# EAGLE schematic wachcio_nawodnienie (EAGLE 7.7.0)

## Sheet 1 of 4: urzadzenie
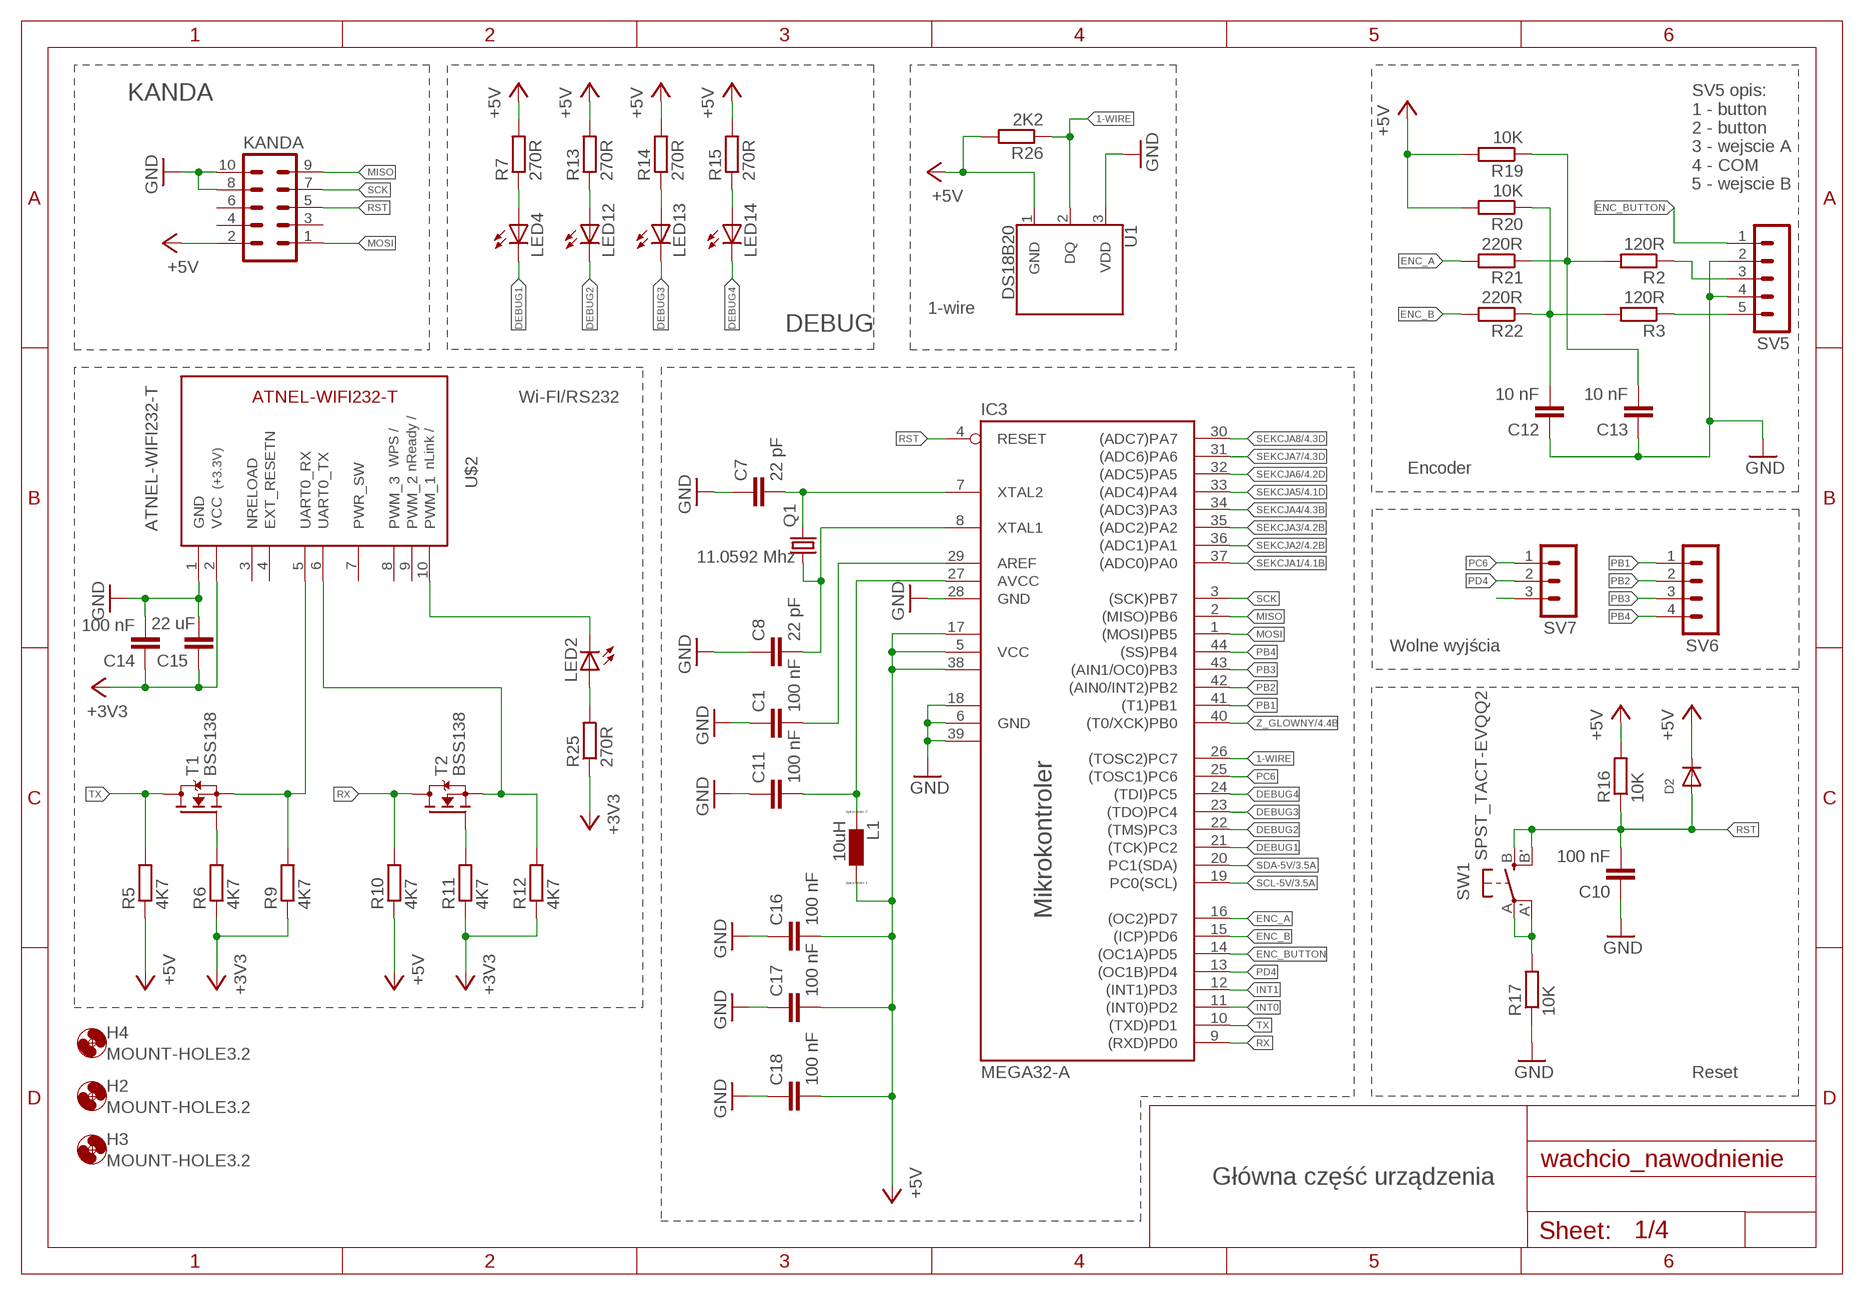
[diagram p0: schematic, sheet 1]

### Parts
C1  100 nF  C-EUC0805  [C0805]
C7  22 pF  C-EUC0805  [C0805]
C8  22 pF  C-EUC0805  [C0805]
C10  100 nF  C-EUC0805  [C0805]
C11  100 nF  C-EUC0805  [C0805]
C12  10 nF  C-EUC0805  [C0805]
C13  10 nF  C-EUC0805  [C0805]
C14  100 nF  C-EUC0805  [C0805]
C15  22 uF  C-EUC0805  [C0805]
C16  100 nF  C-EUC0805  [C0805]
C17  100 nF  C-EUC0805  [C0805]
C18  100 nF  C-EUC0805  [C0805]
D2  DIODESOD-123  [SOD-123]
H2  MOUNT-HOLE3.2  [3,2]
H3  MOUNT-HOLE3.2  [3,2]
H4  MOUNT-HOLE3.2  [3,2]
IC3  MEGA32-A  [TQFP44]
KANDA  ML10  [ML10]
L1  10uH  LL3230M  [L3230M]
LED2  LED3MM  [LED3MM]
LED4  LED3MM  [LED3MM]
LED12  LED3MM  [LED3MM]
LED13  LED3MM  [LED3MM]
LED14  LED3MM  [LED3MM]
Q1  11.0592 Mhz  CRYSTALSM49  [SM49]
R2  120R  R-EU_M0805  [M0805]
R3  120R  R-EU_M0805  [M0805]
R5  4K7  R-EU_M0805  [M0805]
R6  4K7  R-EU_M0805  [M0805]
R7  270R  R-EU_M0805  [M0805]
R9  4K7  R-EU_M0805  [M0805]
R10  4K7  R-EU_M0805  [M0805]
R11  4K7  R-EU_M0805  [M0805]
R12  4K7  R-EU_M0805  [M0805]
R13  270R  R-EU_M0805  [M0805]
R14  270R  R-EU_M0805  [M0805]
R15  270R  R-EU_M0805  [M0805]
R16  10K  R-EU_M0805  [M0805]
R17  10K  R-EU_M0805  [M0805]
R19  10K  R-EU_M0805  [M0805]
R20  10K  R-EU_M0805  [M0805]
R21  220R  R-EU_M0805  [M0805]
R22  220R  R-EU_M0805  [M0805]
R25  270R  R-EU_M0805  [M0805]
R26  2K2  R-EU_M0805  [M0805]
SV5  MA05-1  [MA05-1]
SV6  MA04-1  [MA04-1]
SV7  MA03-1  [MA03-1]
SW1  SPST_TACT-EVQQ2  [EVQ-Q2]
T1  BSS138  MOSFET-N-SOT23  [SOT23]
T2  BSS138  MOSFET-N-SOT23  [SOT23]
U1  DS18B20  [TO-92-AMMO]
U$2  ATNEL-WIFI232-T  [ATNEL-WIFI232-T]

### Nets
1-WIRE: IC3.26((TOSC2)PC7) R26.1 U1.2(DQ)
+3V3: C14.1 C15.1 R6.1 R9.1 R11.1 R12.1 R25.1 U$2.2(VCC) ; also sheet 2
+5V: C16.2 C17.2 C18.2 D2.C IC3.5(VCC) IC3.17(VCC1) IC3.38(VCC2) KANDA.2 L1.1 R5.1 R7.2 R10.1 R13.2 R14.2 R15.2 R16.2 R19.2 R20.2 R26.2 U1.1(GND) ; also sheet 2,3,4
DEBUG1: IC3.21((TCK)PC2) LED4.K(C)
DEBUG2: IC3.22((TMS)PC3) LED12.K(C)
DEBUG3: IC3.23((TDO)PC4) LED13.K(C)
DEBUG4: IC3.24((TDI)PC5) LED14.K(C)
ENC_A: IC3.16((OC2)PD7) R21.2
ENC_B: IC3.15((ICP)PD6) R22.2
ENC_BUTTON: IC3.14((OC1A)PD5) SV5.1
GND: C1.1 C7.1 C8.1 C10.1 C11.1 C12.1 C13.1 C14.2 C15.2 C16.1 C17.1 C18.1 IC3.6(GND) IC3.18(GND1) IC3.28(GND) IC3.39(GND2) KANDA.8 KANDA.10 R17.1 SV5.2 SV5.4 U1.3(VDD) U$2.1(GND) ; also sheet 2,3,4
INT0: IC3.11((INT0)PD2)
INT1: IC3.12((INT1)PD3)
MISO: IC3.2((MISO)PB6) KANDA.9
MOSI: IC3.1((MOSI)PB5) KANDA.1
N$1: R9.2 T1.2(S) U$2.5(UART0_RX)
N$2: C11.2 IC3.27(AVCC) L1.2
N$3: C1.2 IC3.29(AREF)
N$5: LED2.A R25.2
N$6: R6.2 T1.1(G)
N$8: LED2.K(C) U$2.10(PWM_1)
N$9: R12.2 T2.2(S) U$2.6(UART0_TX)
N$10: C7.2 IC3.7(XTAL2) Q1.2
N$11: C8.2 IC3.8(XTAL1) Q1.1
N$15: C12.2 R3.2 R20.1 R22.1
N$16: R17.2 SW1.A'(P1) SW1.A(P)
N$17: C13.2 R2.2 R19.1 R21.1
N$18: R2.1 SV5.3
N$19: R3.1 SV5.5
N$22: R11.2 T2.1(G)
N$25: LED4.A R7.1
N$26: LED12.A R13.1
N$27: LED13.A R14.1
N$31: LED14.A R15.1
N$57: SV7.3
PB1: IC3.41((T1)PB1) SV6.1
PB2: IC3.42((AIN0/INT2)PB2) SV6.2
PB3: IC3.43((AIN1/OC0)PB3) SV6.3
PB4: IC3.44((SS)PB4) SV6.4
PC6: IC3.25((TOSC1)PC6) SV7.1
PD4: IC3.13((OC1B)PD4) SV7.2
RST: C10.2 D2.A IC3.4(RESET) KANDA.5 R16.1 SW1.B'(S1) SW1.B(S)
RX: IC3.9((RXD)PD0) R10.2 T2.3(D)
SCK: IC3.3((SCK)PB7) KANDA.7
SCL-5V: IC3.19(PC0(SCL)) ; also sheet 3
SDA-5V: IC3.20(PC1(SDA)) ; also sheet 3
SEKCJA1: IC3.37((ADC0)PA0) ; also sheet 4
SEKCJA2: IC3.36((ADC1)PA1) ; also sheet 4
SEKCJA3: IC3.35((ADC2)PA2) ; also sheet 4
SEKCJA4: IC3.34((ADC3)PA3) ; also sheet 4
SEKCJA5: IC3.33((ADC4)PA4) ; also sheet 4
SEKCJA6: IC3.32((ADC5)PA5) ; also sheet 4
SEKCJA7: IC3.31((ADC6)PA6) ; also sheet 4
SEKCJA8: IC3.30((ADC7)PA7) ; also sheet 4
TX: IC3.10((TXD)PD1) R5.2 T1.3(D)
Z_GLOWNY: IC3.40((T0/XCK)PB0) ; also sheet 4
Unconnected: KANDA.3 KANDA.4 KANDA.6 U$2.3(NRELOAD) U$2.4(EXT_RESETN) U$2.7(PWR_SW) U$2.8(PWM_3) U$2.9(PWM_2)

### Notes on the sheet
- KANDA
- SV5 opis:
  1 - button
  2 - button
  3 - wejscie A
  4 - COM
  5 - wejscie B
- 1-wire
- DEBUG
- Wi-FI/RS232
- Encoder
- Wolne wyjścia
- Mikrokontroler
- Reset
- Główna część urządzenia

## Sheet 2 of 4: zasilanie
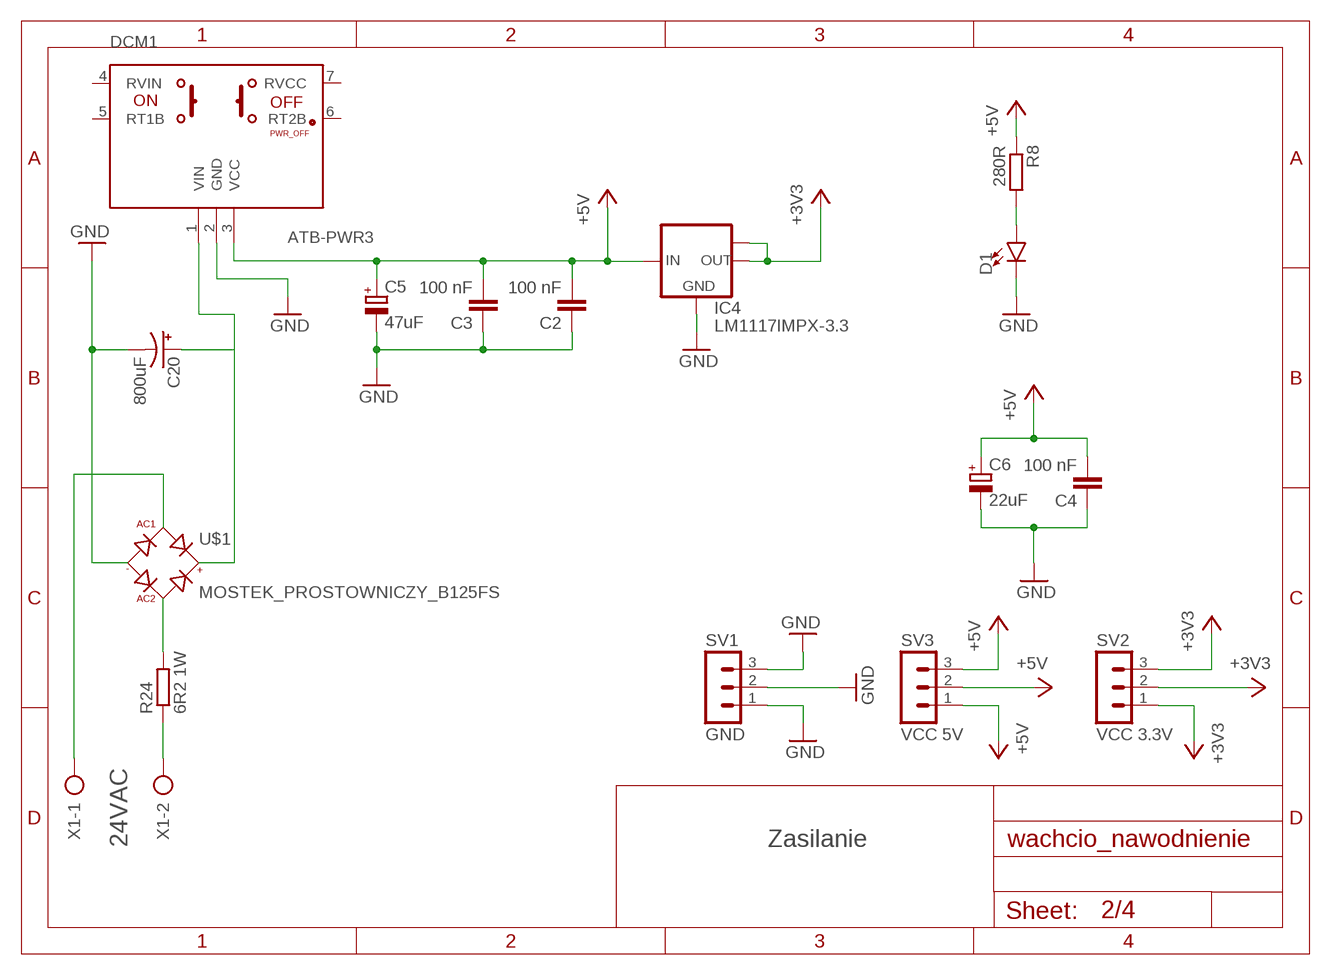
[diagram p1: schematic, sheet 2]

### Parts
C2  100 nF  C-EUC0805  [C0805]
C3  100 nF  C-EUC0805  [C0805]
C4  100 nF  C-EUC0805  [C0805]
C5  47uF  CPOL-EUB45181A  [B45181A]
C6  22uF  CPOL-EUB45181A  [B45181A]
C20  800uF  1000UF-RADIAL-5MM-35V-20%-KIT  [CPOL-RADIAL-5MM-10MM-KIT]
D1  LED5MM  [LED_5MM]
DCM1  ATB-PWR3  [ATB-PWR3]
IC4  LM1117IMPX-3.3  [SOT223]
R8  280R  R-EU_M0805  [M0805]
R24  6R2 1W  R-EU_0309/10  [0309/10]
SV1  GND  MA03-1  [MA03-1]
SV2  VCC 3.3V  MA03-1  [MA03-1]
SV3  VCC 5V  MA03-1  [MA03-1]
U$1  MOSTEK_PROSTOWNICZY_B125FS  [MOSTEK_PROSTOWNICZY_B125FS]
X1  AK500/2  [AK500/2]

### Nets
+3V3: IC4.2(OUT) IC4.TAB(OUT1) SV2.1 SV2.2 SV2.3 ; also sheet 1
+5V: C2.2 C3.2 C4.2 C5.+ C6.+ DCM1.3(VCC) IC4.3(IN) R8.1 SV3.1 SV3.2 SV3.3 ; also sheet 1,3,4
GND: C2.1 C3.1 C4.1 C5.- C6.- C20.- D1.K(C) DCM1.2(GND) IC4.1(GND) SV1.1 SV1.2 SV1.3 U$1.- ; also sheet 1,3,4
N$4: C20.+ DCM1.1(VIN) U$1.+
N$12: D1.A R8.2
N$37: R24.1 X1.2
N$41: R24.2 U$1.AC2
N$45: U$1.AC1 X1.1
Unconnected: DCM1.4(RVIN) DCM1.5(RT1B) DCM1.6(RT2B) DCM1.7(RVCC)

### Notes on the sheet
- 24VAC | Zasilanie

## Sheet 3 of 4: I2C
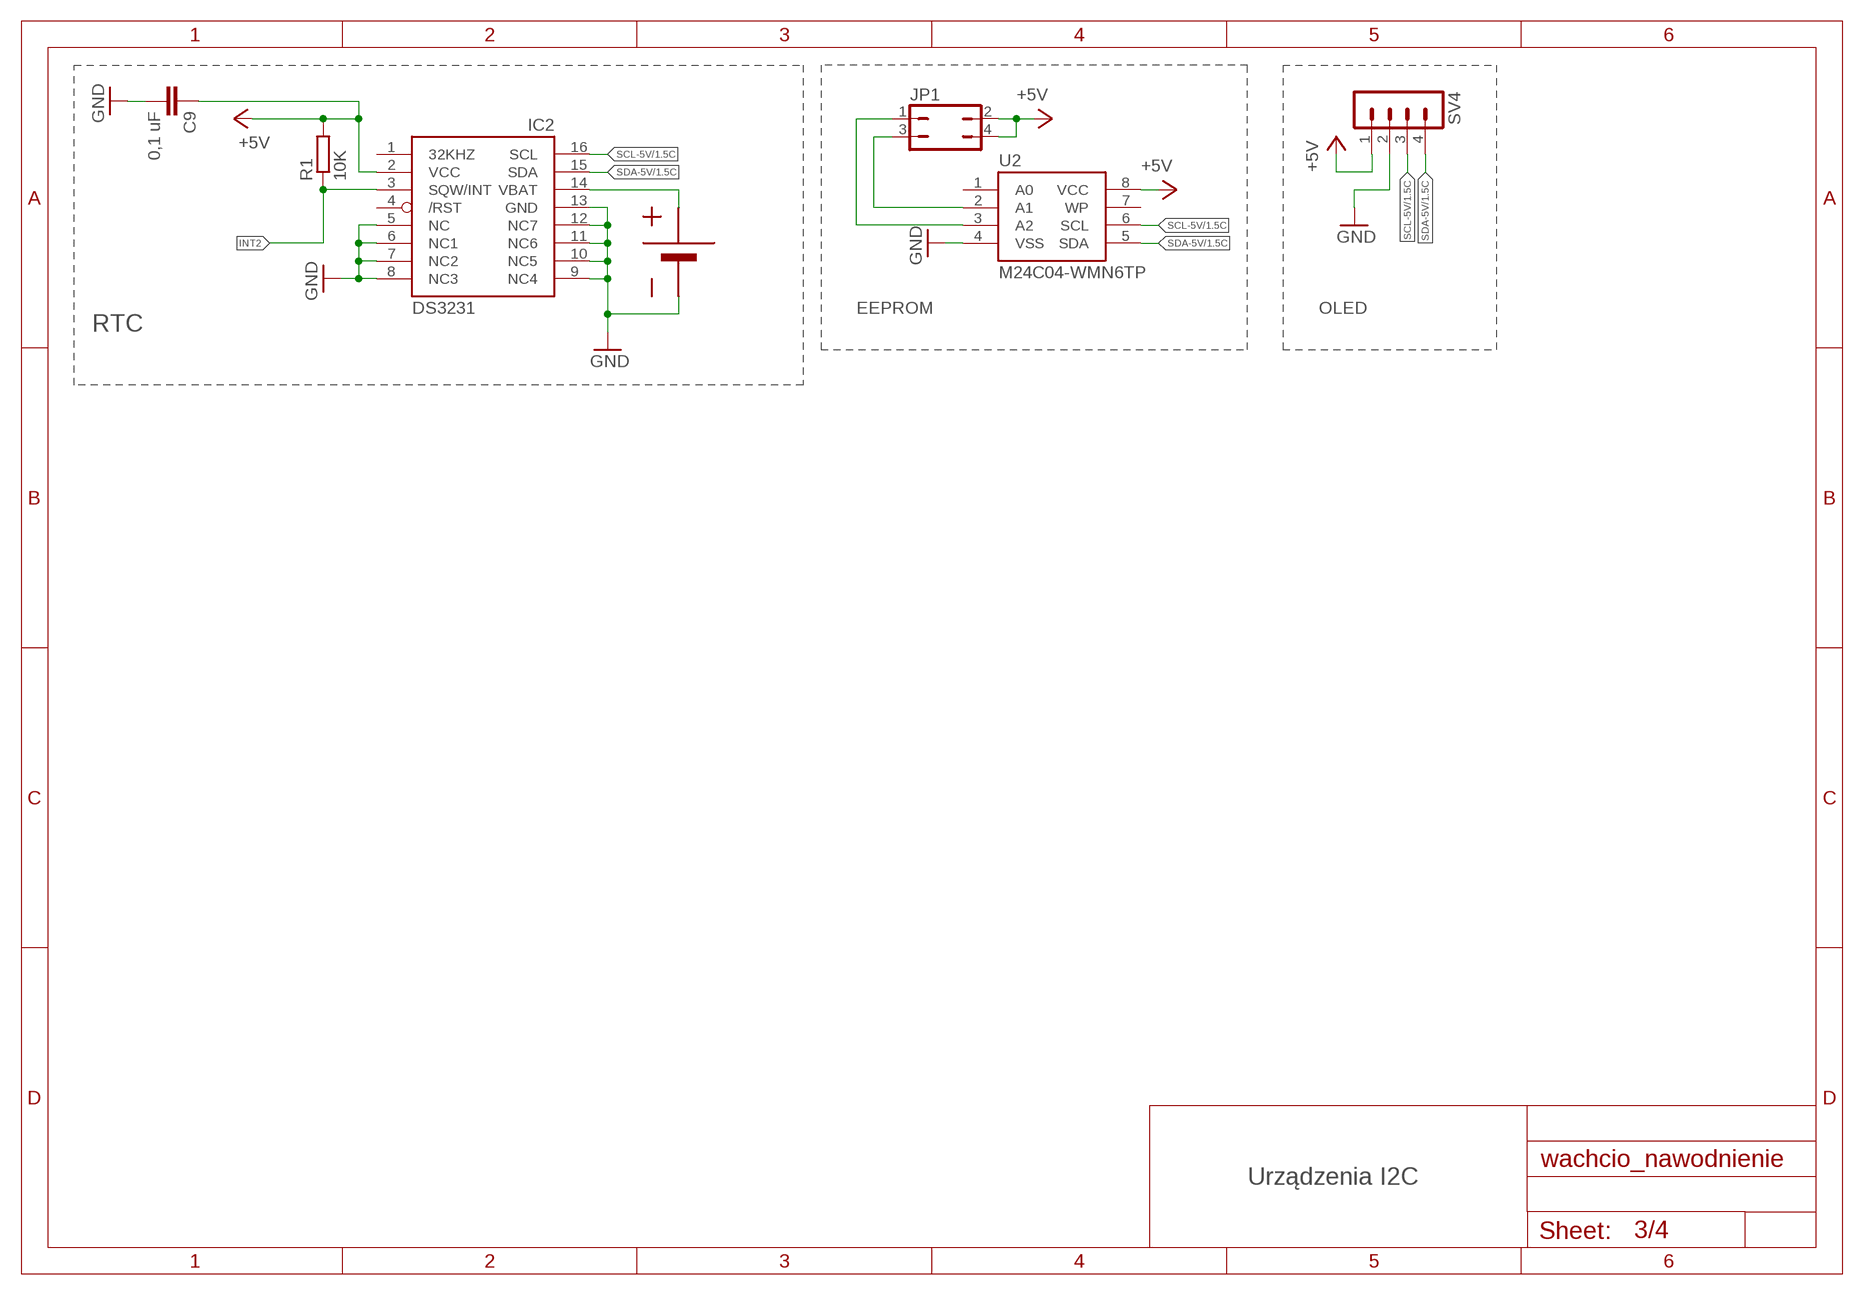
[diagram p2: schematic, sheet 3]

### Parts
C9  0,1 uF  C-EUC0805  [C0805]
IC2  DS3231/SO  [SO16W]
JP1  JP2Q  [JP2Q]
R1  10K  R-EU_M0805  [M0805]
SV4  MA04-1  [MA04-1]
U2  M24C04-WMN6TP  EEPROM-I2CSMD  [SO08]
U$3  BATTERY_CR2032  [BATTERY_CR2032]

### Nets
+5V: C9.1 IC2.2(VCC) JP1.2 JP1.4 R1.2 SV4.1 U2.8(VCC) ; also sheet 1,2,4
GND: C9.2 IC2.5(NC) IC2.6(NC1) IC2.7(NC2) IC2.8(NC3) IC2.9(NC4) IC2.10(NC5) IC2.11(NC6) IC2.12(NC7) IC2.13(GND) SV4.2 U2.4(VSS) U$3.- ; also sheet 1,2,4
INT2: IC2.3(SQW/INT) R1.1
N$7: IC2.14(VBAT) U$3.+
N$32: JP1.3 U2.2(A1)
N$33: JP1.1 U2.3(A2)
SCL-5V: IC2.16(SCL) SV4.3 U2.6(SCL) ; also sheet 1
SDA-5V: IC2.15(SDA) SV4.4 U2.5(SDA) ; also sheet 1
Unconnected: IC2.1(32KHZ) IC2.4(/RST) U2.1(A0) U2.7(WP)

### Notes on the sheet
- EEPROM | OLED
- RTC
- Urządzenia I2C

## Sheet 4 of 4: Przekazniki
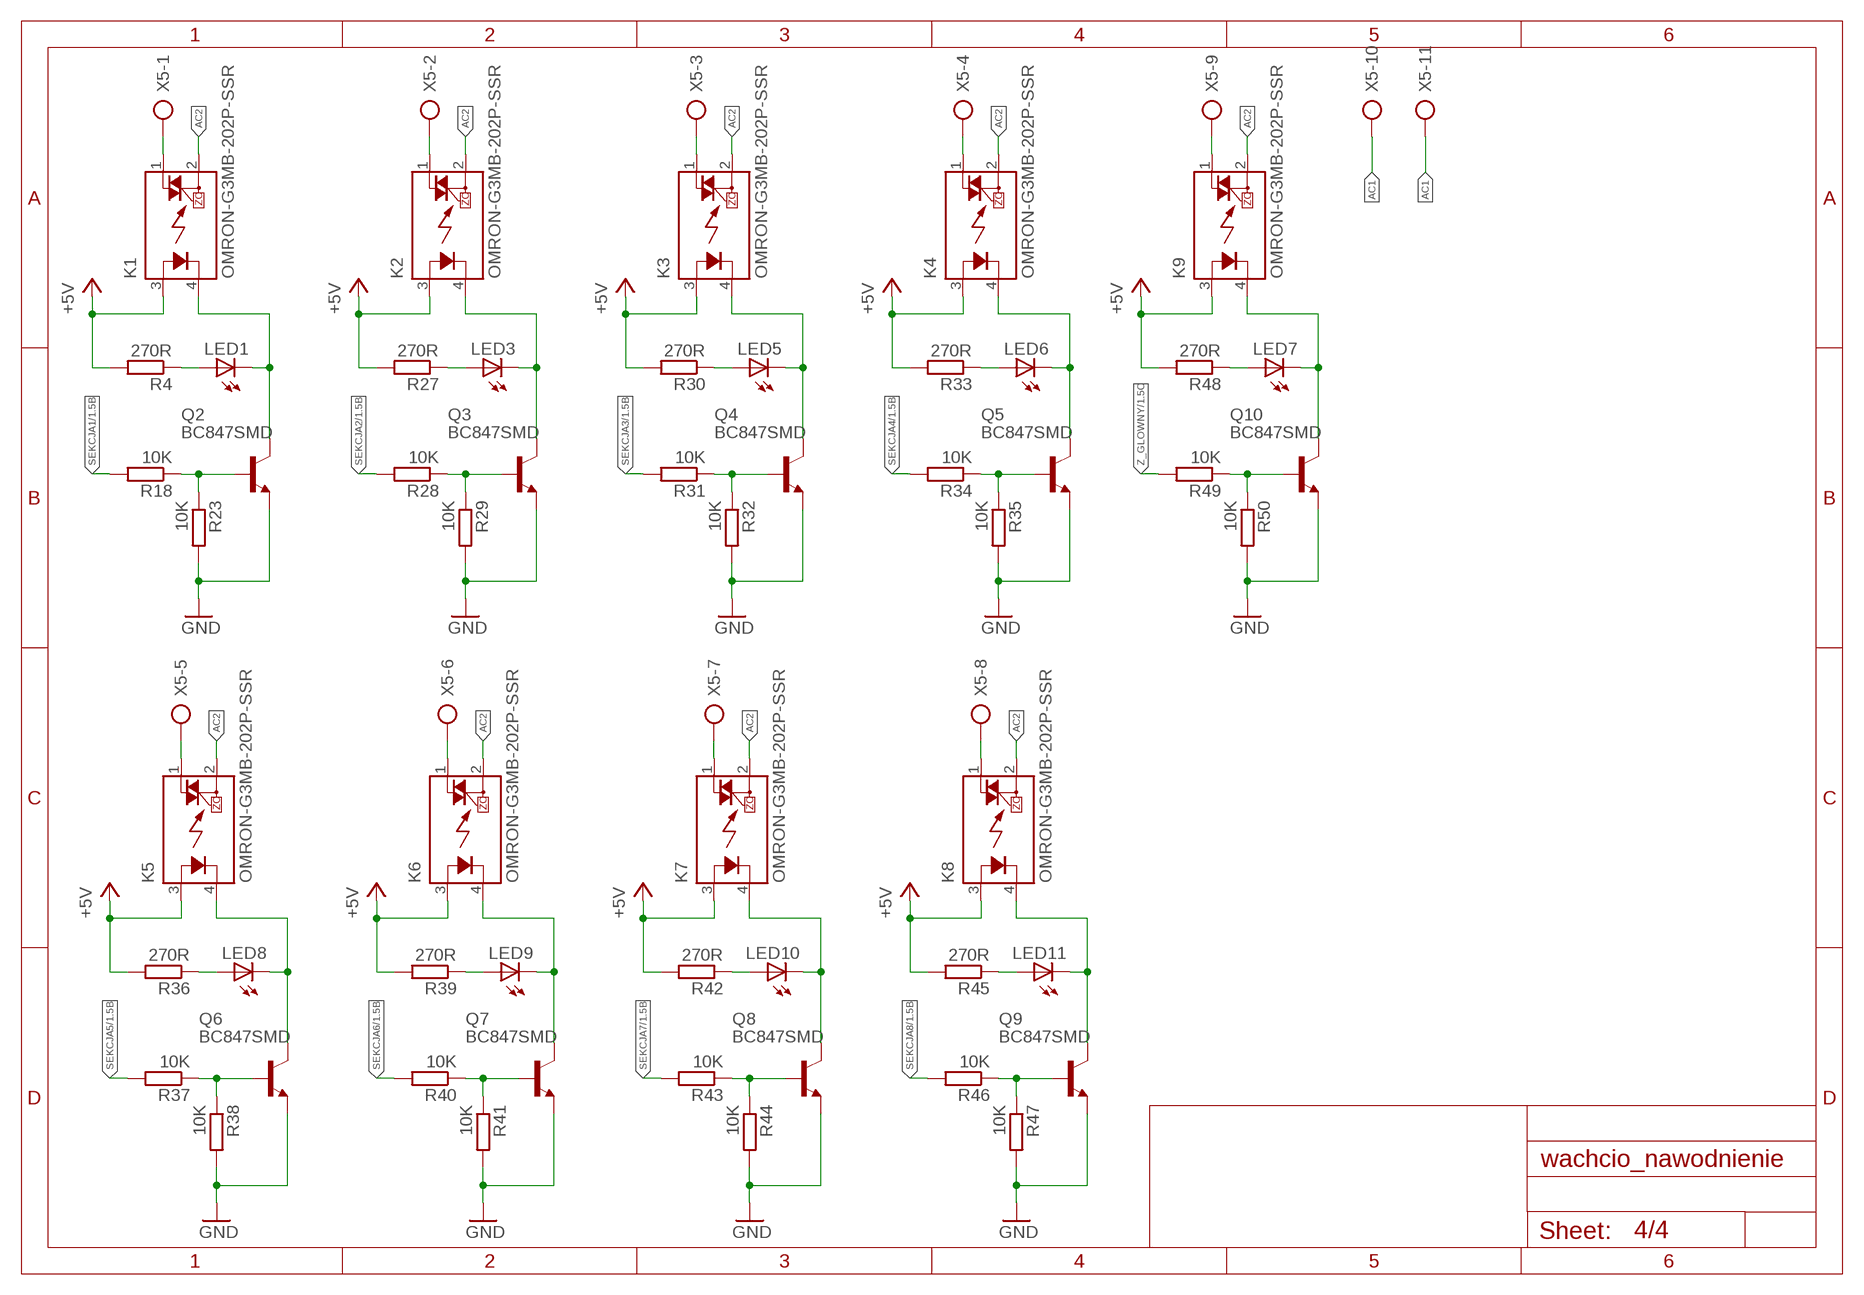
[diagram p3: schematic, sheet 4]

### Parts
K1  OMRON-G3MB-202P-SSR  [OMRON-G3MB-202P-SSR]
K2  OMRON-G3MB-202P-SSR  [OMRON-G3MB-202P-SSR]
K3  OMRON-G3MB-202P-SSR  [OMRON-G3MB-202P-SSR]
K4  OMRON-G3MB-202P-SSR  [OMRON-G3MB-202P-SSR]
K5  OMRON-G3MB-202P-SSR  [OMRON-G3MB-202P-SSR]
K6  OMRON-G3MB-202P-SSR  [OMRON-G3MB-202P-SSR]
K7  OMRON-G3MB-202P-SSR  [OMRON-G3MB-202P-SSR]
K8  OMRON-G3MB-202P-SSR  [OMRON-G3MB-202P-SSR]
K9  OMRON-G3MB-202P-SSR  [OMRON-G3MB-202P-SSR]
LED1  LED3MM  [LED3MM]
LED3  LED3MM  [LED3MM]
LED5  LED3MM  [LED3MM]
LED6  LED3MM  [LED3MM]
LED7  LED3MM  [LED3MM]
LED8  LED3MM  [LED3MM]
LED9  LED3MM  [LED3MM]
LED10  LED3MM  [LED3MM]
LED11  LED3MM  [LED3MM]
Q2  BC847SMD  [SOT23]
Q3  BC847SMD  [SOT23]
Q4  BC847SMD  [SOT23]
Q5  BC847SMD  [SOT23]
Q6  BC847SMD  [SOT23]
Q7  BC847SMD  [SOT23]
Q8  BC847SMD  [SOT23]
Q9  BC847SMD  [SOT23]
Q10  BC847SMD  [SOT23]
R4  270R  R-EU_M0805  [M0805]
R18  10K  R-EU_M0805  [M0805]
R23  10K  R-EU_M0805  [M0805]
R27  270R  R-EU_M0805  [M0805]
R28  10K  R-EU_M0805  [M0805]
R29  10K  R-EU_M0805  [M0805]
R30  270R  R-EU_M0805  [M0805]
R31  10K  R-EU_M0805  [M0805]
R32  10K  R-EU_M0805  [M0805]
R33  270R  R-EU_M0805  [M0805]
R34  10K  R-EU_M0805  [M0805]
R35  10K  R-EU_M0805  [M0805]
R36  270R  R-EU_M0805  [M0805]
R37  10K  R-EU_M0805  [M0805]
R38  10K  R-EU_M0805  [M0805]
R39  270R  R-EU_M0805  [M0805]
R40  10K  R-EU_M0805  [M0805]
R41  10K  R-EU_M0805  [M0805]
R42  270R  R-EU_M0805  [M0805]
R43  10K  R-EU_M0805  [M0805]
R44  10K  R-EU_M0805  [M0805]
R45  270R  R-EU_M0805  [M0805]
R46  10K  R-EU_M0805  [M0805]
R47  10K  R-EU_M0805  [M0805]
R48  270R  R-EU_M0805  [M0805]
R49  10K  R-EU_M0805  [M0805]
R50  10K  R-EU_M0805  [M0805]
X5  AK500/11  [AK500/11]

### Nets
+5V: K1.3(A) K2.3(A) K3.3(A) K4.3(A) K5.3(A) K6.3(A) K7.3(A) K8.3(A) K9.3(A) R4.2 R27.2 R30.2 R33.2 R36.2 R39.2 R42.2 R45.2 R48.2 ; also sheet 1,2,3
AC1: X5.10
AC2: K1.2(DS2) K9.2(DS2)
GND: Q2.2(E) Q3.2(E) Q4.2(E) Q5.2(E) Q6.2(E) Q7.2(E) Q8.2(E) Q9.2(E) Q10.2(E) R23.2 R29.2 R32.2 R35.2 R38.2 R41.2 R44.2 R47.2 R50.2 ; also sheet 1,2,3
N$13: LED1.A R4.1
N$14: K1.4(K) LED1.K(C) Q2.3(C)
N$20: LED3.A R27.1
N$21: K9.1(DS1) X5.9
N$23: Q2.1(B) R18.1 R23.1
N$24: K2.4(K) LED3.K(C) Q3.3(C)
N$28: Q3.1(B) R28.1 R29.1
N$29: LED5.A R30.1
N$30: K3.4(K) LED5.K(C) Q4.3(C)
N$34: Q4.1(B) R31.1 R32.1
N$35: LED6.A R33.1
N$36: K4.4(K) LED6.K(C) Q5.3(C)
N$38: Q5.1(B) R34.1 R35.1
N$39: LED8.A R36.1
N$40: K5.4(K) LED8.K(C) Q6.3(C)
N$42: Q6.1(B) R37.1 R38.1
N$43: LED9.A R39.1
N$44: K6.4(K) LED9.K(C) Q7.3(C)
N$46: Q7.1(B) R40.1 R41.1
N$47: LED10.A R42.1
N$48: K7.4(K) LED10.K(C) Q8.3(C)
N$50: Q8.1(B) R43.1 R44.1
N$51: LED11.A R45.1
N$52: K8.4(K) LED11.K(C) Q9.3(C)
N$54: Q9.1(B) R46.1 R47.1
N$55: LED7.A R48.1
N$56: K9.4(K) LED7.K(C) Q10.3(C)
N$58: Q10.1(B) R49.1 R50.1
N$59: K1.1(DS1) X5.1
N$60: K2.1(DS1) X5.2
N$61: K3.1(DS1) X5.3
N$62: K4.1(DS1) X5.4
N$63: K5.1(DS1) X5.5
N$64: K6.1(DS1) X5.6
N$65: K7.1(DS1) X5.7
N$66: K8.1(DS1) X5.8
SEKCJA1: R18.2 ; also sheet 1
SEKCJA2: R28.2 ; also sheet 1
SEKCJA3: R31.2 ; also sheet 1
SEKCJA4: R34.2 ; also sheet 1
SEKCJA5: R37.2 ; also sheet 1
SEKCJA6: R40.2 ; also sheet 1
SEKCJA7: R43.2 ; also sheet 1
SEKCJA8: R46.2 ; also sheet 1
Z_GLOWNY: R49.2 ; also sheet 1
Unconnected: K2.2(DS2) K3.2(DS2) K4.2(DS2) K5.2(DS2) K6.2(DS2) K7.2(DS2) K8.2(DS2) X5.11

## Library data of the parts
C1-C4 C7-C18 = rcl:C-EU: CAPACITOR, European symbol
C5 C6 = rcl:CPOL-EU: POLARIZED CAPACITOR, European symbol
C20 = SparkFun-Capacitors:1000UF: 1,000µF/1mF ceramic capacitors A capacitor is a passive two-terminal electrical component used to store electrical energy temporarily in an electric field. CAP-08070; PROD_ID: CAP-09538; VALUE: 1mf
D1 = SparkFun-LED:LED: LED (Generic) Standard schematic elements and footprints for 5mm, 3mm, 1206, and 0603 sized LEDs. Generic LEDs with no color specified.
D2 = adafruit:DIODE: Diode SMADIODE - SMA Surface Mount Package 20V 1A Schottky Diode Digikey: 641-1014-6-ND DO-1N4148 - Through Hole Small Current Diode SOD-123 20V 1 A (.5mV Vf) Schottky Diode - Digikey: MBRX120TPMSCT-ND SOD-323 10V 570mA (.38mV Vf, 3ns) Schottky Diode - Digikey: ZLLS410CT-ND SOD-523 30V 30mA Schottky Diode (RB751S-40TE61) - Digikey: RB751S-40TE61CT-ND SOT23-R/W - SOT23 Package (R = Solder Paste/Reflow Ovens, W = Hand-Soldering) BAT54Film 40V 300mA - Digikey: 497-7162-1-ND
DCM1 = _ATNEL:ATB-PWR3
H2-H4 = holes:MOUNT-HOLE: MOUNTING HOLE with drill center marker
IC2 = adafruit:DS3231
IC3 = atmel:MEGA32: MICROCONTROLLER 32 Kbytes FLASH 2 Kbytes SRAM 1 Kbytes EEPROM USART 8-channel 10 bit ADC Source: www.atmel.com .. doc2503.pdf; MPN: ATMEGA32-16AU; OC_FARNELL: 9171274; OC_NEWARK: 69K6677
IC4 = lm1117:LM1117IMPX-*
JP1 = jumper:JP2Q: JUMPER
K1-K9 = wachcio:OMRON-G3MB-202P-SSR: IT(rms) 8A, Zero Cross type SIP 4pin Triac output SSR Source: http://sharp-world.com/products/device/lineup/data/pdf/datasheet/s102s02_e.pdf
KANDA = con-harting-ml:ML10: HARTING; OC_FARNELL: unknown; OC_NEWARK: unknown
L1 = eagle-ltspice:L: INDUCTOR, European symbol; SPICEMODEL: NONE; SPICEPREFIX: L
LED1-LED14 = adafruit:LED: LED OSRAM: - CHIPLED LG R971, LG N971, LY N971, LG Q971, LY Q971, LO R971, LY R971 LH N974, LH R974 LS Q976, LO Q976, LY Q976 LO Q996 - Hyper CHIPLED LW Q18S LB Q993, LB Q99A, LB R99A - SideLED LS A670, LO A670, LY A670, LG A670, LP A670 LB A673, LV A673, LT A673, LW A673 LH A674 LY A675 LS A676, LA A676, LO A676, LY A676, LW A676 LS A679, LY A679, LG A679 - Hyper Micro SIDELED® LS Y876, LA Y876, LO Y876, LY Y876 LT Y87S - SmartLED LW L88C, LW L88S LB L89C, LB L89S, LG L890 LS L89K, LO L89K, LY L89K LS L896, LA L896, LO L896, LY L896 - TOPLED LS T670, LO T670, LY T670, LG T670, LP T670 LSG T670, LSP T670, LSY T670, LOP T670, LYG T670 LG T671, LOG T671, LSG T671 LB T673, LV T673, LT T673, LW T673 LH T674 LS T676, LA T676, LO T676, LY T676, LB T676, LH T676, LSB T676, LW T676 LB T67C, LV T67C, LT T67C, LS T67K, LO T67K, LY T67K, LW E67C LS E67B, LA E67B, LO E67B, LY E67B, LB E67C, LV E67C, LT E67C LW T67C LS T679, LY T679, LG T679 LS T770, LO T770, LY T770, LG T770, LP T770 LB T773, LV T773, LT T773, LW T773 LH T774 LS E675, LA E675, LY E675, LS T675 LS T776, LA T776, LO T776, LY T776, LB T776 LHGB T686 LT T68C, LB T68C - Hyper Mini TOPLED® LB M676 - Mini TOPLED Santana® LG M470 LS M47K, LO M47K, LY M47K Source: http://www.osram.convergy.de/
Q1 = adafruit:CRYSTAL: CRYSTAL; OC_FARNELL: unknown; OC_NEWARK: unknown
Q2-Q10 = transistor-npn:BC847*: NPN Transistor
R1-R3 R5 R6 R8-R12 R16 R17 R19-R22 R25 R26 = rcl:R-EU_: RESISTOR, European symbol
R4 R7 R13-R15 R18 R23 R27-R50 = wachcio:R-EU_: RESISTOR, European symbol
R24 = resistor:R-EU_: RESISTOR, European symbol
SV1-SV3 SV7 = con-lstb:MA03-1: PIN HEADER; OC_FARNELL: unknown; OC_NEWARK: unknown
SV4 SV6 = con-lstb:MA04-1: PIN HEADER; OC_FARNELL: unknown; OC_NEWARK: unknown
SV5 = con-lstb:MA05-1: PIN HEADER; OC_FARNELL: unknown; OC_NEWARK: unknown
SW1 = adafruit:SPST_TACT: SMT 6mm switch, EVQQ2 series http://www.ladyada.net/library/eagle
T1 T2 = we-transistor:MOSFET-N: N-Channel MOSFET SOT23 N-Chn MOSFET TSM3404, IRLML2502 (Vgs>=+/-20V, Vds<=20V, Id>=3A + Rds<=0.05Ohm @ Vgs=4.5V) BSS138 (Vgs>=+/-20V, Vds<=40V, Id>=0.2A + Rds<=3Ohm @ Vgs=4.5V) SOT223 Low Side Switch with Protection (Infineon) BSP76 (Vin=0...10V, Vds<=42V, Id=1.4A + Rds=0.2Ohm @ Vin=5V) BSP77 (Vin=0...10V, Vds<=42V, Id=2.2A + Rds=0.1Ohm @ Vin=5V) D²Pak Low Side Switch with Protection (Infineon) BTS117TC (Vin=0...10V, Vds<=60V, Id=3.5A + Rds=0.12Ohm @ Vin=5V) BTS133TC (Vin=0...10V, Vds<=60V, Id=7A + Rds=0.06Ohm @ Vin=5V) BTS141TC (Vin=0...10V, Vds<=60V, Id=12A + Rds=0.03Ohm @ Vin=5V) BTS3018TC (Vin=0...10V, Vds<=60V, Id=6A + Rds=0.02Ohm @ Vin=5V)
U1 = SparkFun-Sensors:DS18B20: Dallas/Maxim DS18B20 1-Wire Temperature Sensor The DS18B20 reports degrees C with 9 to 12-bit precision, -55C to 125C (+/-0.5C). Each sensor has a unique 64-Bit Serial number etched into it - allows for a huge number of sensors to be used on one data bus. Datasheet <http://datasheets.maximintegrated.com/en/ds/DS18B20.pdf> SparkFun Products One Wire Digital Temperature Sensor - DS18B20 <https://www.sparkfun.com/products/245> (SEN-00245); STORE_ID: SEN-00245
U2 = SparkFun-IC-Memory:EEPROM-I2C: I2C EEPROMs, 24LC256 and others 24LC256 Series 256 kb I2C 2 Wire (32 k x 8 Bit) 2.5 V Serial EEPROM SMD - SOIC-8 Datasheet SparkFun Products SparkFun UDB5 - PIC UAV Development Board <https://www.sparkfun.com/products/11703> (GPS-11703); PROD_ID: IC-09714; VALUE: 24LC256
U$1 = wachcio:MOSTEK_PROSTOWNICZY_B125FS
U$2 = ATNEL-WIFI232-T:ATNEL-WIFI232-T
U$3 = wachcio:BATTERY_CR2032
X1 = con-ptr500:AK500/2: CONNECTOR; OC_FARNELL: unknown; OC_NEWARK: unknown
X5 = con-ptr500:AK500/11: CONNECTOR; OC_FARNELL: unknown; OC_NEWARK: unknown